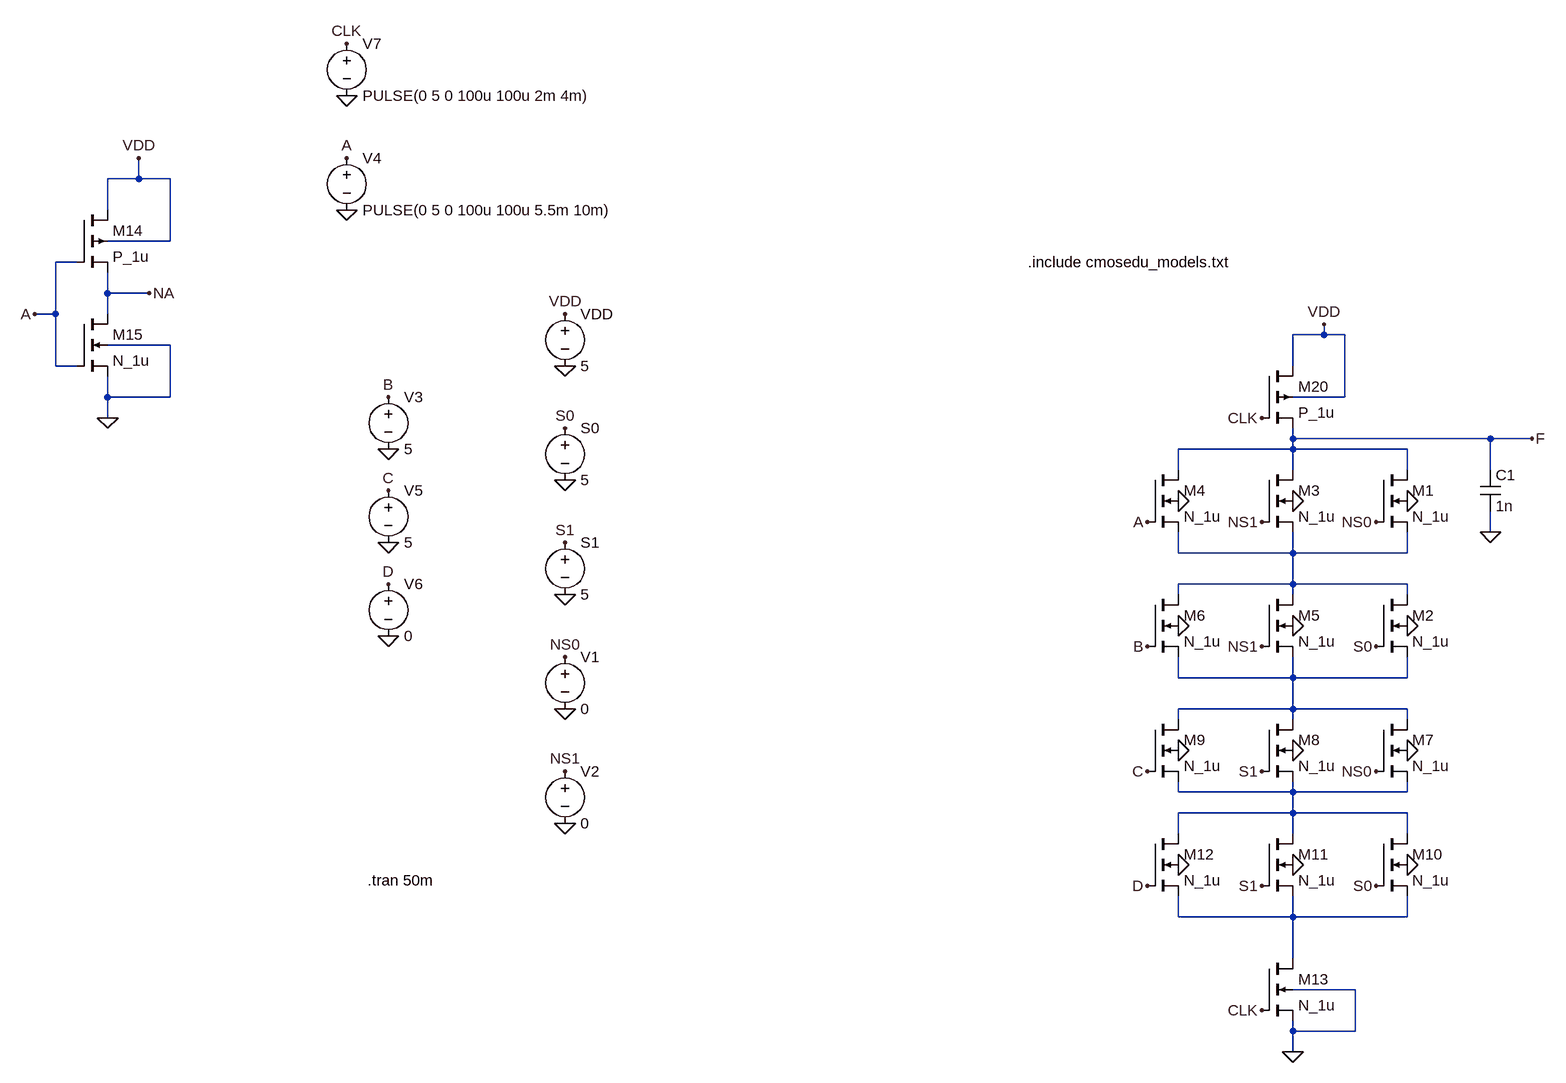
[diagram p0: schematic Mux1U.asc]
Mux1U.asc, the LTspice schematic file:
Version 4.1
SHEET 1 1960 1252
WIRE -1392 -112 -1392 -144
WIRE -1392 -112 -1440 -112
WIRE -1344 -112 -1392 -112
WIRE -1440 -64 -1440 -112
WIRE -1344 -16 -1344 -112
WIRE -1344 -16 -1440 -16
WIRE -1488 16 -1520 16
WIRE -1440 64 -1440 32
WIRE -1376 64 -1440 64
WIRE -1520 96 -1520 16
WIRE -1520 96 -1552 96
WIRE -1440 96 -1440 64
WIRE 432 128 432 112
WIRE 432 128 384 128
WIRE 464 128 432 128
WIRE -1344 144 -1440 144
WIRE -1520 176 -1520 96
WIRE -1488 176 -1520 176
WIRE 384 176 384 128
WIRE -1440 224 -1440 192
WIRE -1344 224 -1344 144
WIRE -1344 224 -1440 224
WIRE 464 224 464 128
WIRE 464 224 384 224
WIRE -1440 256 -1440 224
WIRE 384 288 384 272
WIRE 688 288 384 288
WIRE 752 288 688 288
WIRE 384 304 384 288
WIRE 384 304 208 304
WIRE 560 304 384 304
WIRE 208 336 208 304
WIRE 384 336 384 304
WIRE 560 336 560 304
WIRE 688 336 688 288
WIRE 688 432 688 400
WIRE 208 464 208 432
WIRE 384 464 384 432
WIRE 384 464 208 464
WIRE 560 464 560 432
WIRE 560 464 384 464
WIRE 384 512 384 464
WIRE 384 512 208 512
WIRE 560 512 384 512
WIRE 208 528 208 512
WIRE 384 528 384 512
WIRE 560 528 560 512
WIRE 208 656 208 624
WIRE 384 656 384 624
WIRE 384 656 208 656
WIRE 560 656 560 624
WIRE 560 656 384 656
WIRE 384 704 384 656
WIRE 384 704 208 704
WIRE 560 704 384 704
WIRE 208 720 208 704
WIRE 384 720 384 704
WIRE 560 720 560 704
WIRE 208 832 208 816
WIRE 384 832 384 816
WIRE 384 832 208 832
WIRE 560 832 560 816
WIRE 560 832 384 832
WIRE 384 864 384 832
WIRE 384 864 208 864
WIRE 560 864 384 864
WIRE 208 896 208 864
WIRE 384 896 384 864
WIRE 560 896 560 864
WIRE 208 1024 208 992
WIRE 384 1024 384 992
WIRE 384 1024 208 1024
WIRE 560 1024 560 992
WIRE 560 1024 384 1024
WIRE 384 1088 384 1024
WIRE 480 1136 384 1136
WIRE 384 1200 384 1184
WIRE 480 1200 480 1136
WIRE 480 1200 384 1200
WIRE 384 1232 384 1200
FLAG 336 256 CLK
FLAG 432 112 VDD
FLAG -736 880 0
FLAG -1008 304 0
FLAG -736 176 0
FLAG -736 352 0
FLAG -736 528 0
FLAG -736 704 0
FLAG -736 96 VDD
FLAG -736 272 S0
FLAG -736 448 S1
FLAG -736 624 NS0
FLAG -736 800 NS1
FLAG -1072 -64 0
FLAG -1008 448 0
FLAG -1008 592 0
FLAG -1072 -240 0
FLAG -1072 -144 A
FLAG -1008 224 B
FLAG -1008 368 C
FLAG -1008 512 D
FLAG -1072 -320 CLK
FLAG 384 1232 0
FLAG 336 1168 CLK
FLAG 160 416 A
FLAG 336 416 NS1
FLAG 512 416 NS0
FLAG 160 608 B
FLAG 336 608 NS1
FLAG 512 608 S0
FLAG 160 800 C
FLAG 336 800 S1
FLAG 512 800 NS0
FLAG 160 976 D
FLAG 336 976 S1
FLAG 512 976 S0
FLAG 752 288 F
FLAG -1440 256 0
FLAG -1552 96 A
FLAG -1376 64 NA
FLAG 208 768 0
FLAG 384 768 0
FLAG 560 768 0
FLAG 560 944 0
FLAG 384 944 0
FLAG 208 944 0
FLAG 208 576 0
FLAG 384 576 0
FLAG 560 576 0
FLAG 208 384 0
FLAG 384 384 0
FLAG 560 384 0
FLAG -1392 -144 VDD
FLAG 688 432 0
SYMBOL nmos4 512 336 R0
SYMATTR InstName M1
SYMATTR Value N_1u
SYMBOL nmos4 336 336 R0
SYMATTR InstName M3
SYMATTR Value N_1u
SYMBOL nmos4 160 336 R0
SYMATTR InstName M4
SYMATTR Value N_1u
SYMBOL pmos4 336 176 R0
SYMATTR InstName M20
SYMATTR Value P_1u
SYMBOL voltage -736 80 R0
SYMATTR InstName VDD
SYMATTR Value 5
SYMBOL voltage -736 256 R0
WINDOW 123 0 0 Left 0
WINDOW 39 0 0 Left 0
SYMATTR InstName S0
SYMATTR Value 5
SYMBOL voltage -736 432 R0
SYMATTR InstName S1
SYMATTR Value 5
SYMBOL voltage -736 608 R0
SYMATTR InstName V1
SYMATTR Value 0
SYMBOL voltage -736 784 R0
SYMATTR InstName V2
SYMATTR Value 0
SYMBOL voltage -1008 208 R0
SYMATTR InstName V3
SYMATTR Value 5
SYMBOL voltage -1072 -160 R0
WINDOW 123 0 0 Left 0
WINDOW 39 0 0 Left 0
SYMATTR InstName V4
SYMATTR Value PULSE(0 5 0 100u 100u 5.5m 10m)
SYMBOL voltage -1008 352 R0
SYMATTR InstName V5
SYMATTR Value 5
SYMBOL voltage -1008 496 R0
SYMATTR InstName V6
SYMATTR Value 0
SYMBOL voltage -1072 -336 R0
WINDOW 123 0 0 Left 0
WINDOW 39 0 0 Left 0
SYMATTR InstName V7
SYMATTR Value PULSE(0 5 0 100u 100u 2m 4m)
SYMBOL nmos4 512 528 R0
SYMATTR InstName M2
SYMATTR Value N_1u
SYMBOL nmos4 336 528 R0
SYMATTR InstName M5
SYMATTR Value N_1u
SYMBOL nmos4 160 528 R0
SYMATTR InstName M6
SYMATTR Value N_1u
SYMBOL nmos4 512 720 R0
SYMATTR InstName M7
SYMATTR Value N_1u
SYMBOL nmos4 336 720 R0
SYMATTR InstName M8
SYMATTR Value N_1u
SYMBOL nmos4 160 720 R0
SYMATTR InstName M9
SYMATTR Value N_1u
SYMBOL nmos4 512 896 R0
SYMATTR InstName M10
SYMATTR Value N_1u
SYMBOL nmos4 336 896 R0
SYMATTR InstName M11
SYMATTR Value N_1u
SYMBOL nmos4 160 896 R0
SYMATTR InstName M12
SYMATTR Value N_1u
SYMBOL nmos4 336 1088 R0
SYMATTR InstName M13
SYMATTR Value N_1u
SYMBOL pmos4 -1488 -64 R0
SYMATTR InstName M14
SYMATTR Value P_1u
SYMBOL nmos4 -1488 96 R0
SYMATTR InstName M15
SYMATTR Value N_1u
SYMBOL cap 672 336 R0
SYMATTR InstName C1
SYMATTR Value 1n
TEXT -24 16 Left 2 !.include cmosedu_models.txt
TEXT -1040 968 Left 2 !.tran 50m

The netlist it stands for:
* Mux1U.asc
M1 F NS0 N001 0 N_1u
M3 F NS1 N001 0 N_1u
M4 F A N001 0 N_1u
M20 VDD CLK F VDD P_1u
VDD VDD 0 5
V§S0 S0 0 5
V§S1 S1 0 5
V1 NS0 0 0
V2 NS1 0 0
V3 B 0 5
V4 A 0 PULSE(0 5 0 100u 100u 5.5m 10m)
V5 C 0 5
V6 D 0 0
V7 CLK 0 PULSE(0 5 0 100u 100u 2m 4m)
M2 N001 S0 N002 0 N_1u
M5 N001 NS1 N002 0 N_1u
M6 N001 B N002 0 N_1u
M7 N002 NS0 N003 0 N_1u
M8 N002 S1 N003 0 N_1u
M9 N002 C N003 0 N_1u
M10 N003 S0 N004 0 N_1u
M11 N003 S1 N004 0 N_1u
M12 N003 D N004 0 N_1u
M13 N004 CLK 0 0 N_1u
M14 VDD A NA VDD P_1u
M15 NA A 0 0 N_1u
C1 F 0 1n
.model NMOS NMOS
.model PMOS PMOS
.lib standard.mos
.include cmosedu_models.txt
.tran 50m
.backanno
.end